# EAGLE design Proyecto etapa 1 y 2 (EAGLE 7.5.0)
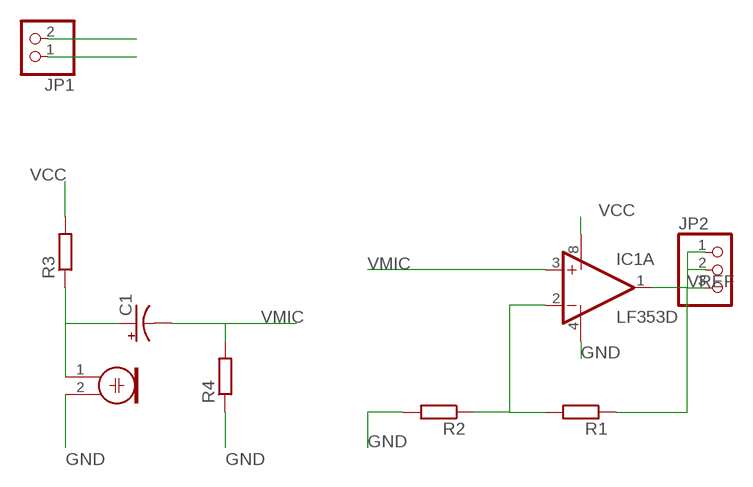
[diagram p0: schematic, sheet 1]

## Parts
C1  CPOL-USC/6032-28R  [C/6032-28R]
IC1  LF353D  [SO08]
JP1  PINHD-1X2  [1X02]
JP2  PINHD-1X3  [1X03]
M1  ELECTRET_MICROPHON-WM-62PC/62PK  [WM-62PC/62PK]
R1  R-EU_R0603  [R0603]
R2  R-EU_R0603  [R0603]
R3  R-EU_R0603  [R0603]
R4  R-EU_R0603  [R0603]

## Nets
GND: IC1.4(P:V-) JP1.2 M1.2 R2.2 R4.1
N$1: C1.+ M1.1 R3.1
N$2: IC1.2(A:-IN) R1.2 R2.1
VCC: IC1.8(P:V+) JP1.1 R3.2
VMIC: C1.- IC1.3(A:+IN) R4.2
VREF: IC1.1(A:OUT) JP2.1 JP2.2 JP2.3 R1.1
Unconnected: IC1.5(B:+IN) IC1.6(B:-IN) IC1.7(B:OUT)

## Library data of the parts
C1 = rcl:CPOL-US: POLARIZED CAPACITOR, American symbol
IC1 = linear:LF353: OP AMP
JP1 = pinhead:PINHD-1X2: PIN HEADER
JP2 = pinhead:PINHD-1X3: PIN HEADER
M1 = microphon:ELECTRET_MICROPHON-: Electret Condenser Microphone
R1-R4 = rcl:R-EU_: RESISTOR, European symbol

## Board
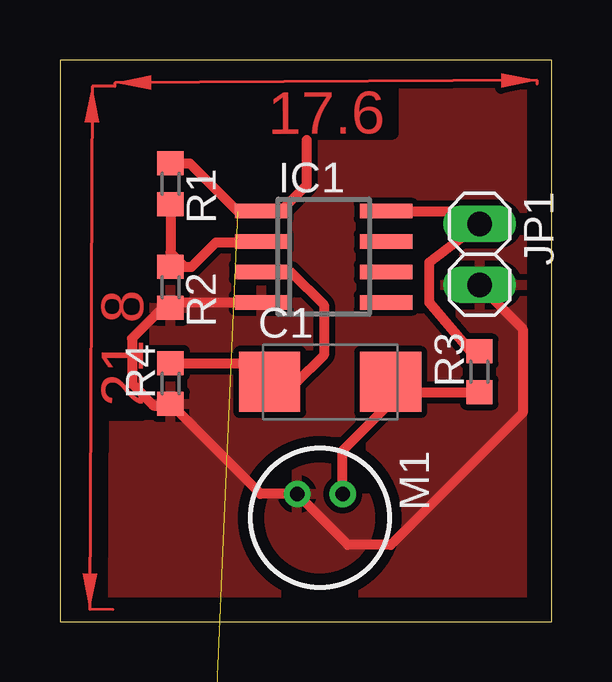
[diagram p1: board, top side]

Size 20.5 x 23.4 mm. Coordinates in mm from the lower left corner, seen from the top.
Outline: 0,0 20.5,0 20.5,23.4 0,23.4 0,0
Copper layers (1*16): Top 0.035mm / dielectric 1.5mm / Bottom 0.035mm
Design rules "default": minimum track width 10mil, minimum drill 24mil, track to track 8mil, track to pad 8mil, pad to pad 8mil, via to via 8mil, smd to smd 8mil, copper to edge 40mil, drill to drill 8mil, minimum pad ring 10mil, minimum via ring 8mil, stop-mask expansion 4mil, vias tented up to drill 0mil, thermal gap 10mil

### Footprints (pad centres in the part's own frame; a part is rotated, then mirrored left to right if it is on the bottom)
C/6032-28R = smd 2.55 x 2.5: + 2.525,0; - -2.525,0
SO08 = smd 0.6 x 2.2: 1 -1.905,-2.6; 2 -0.635,-2.6; 3 0.635,-2.6; 4 1.905,-2.6; 5 1.905,2.6; 6 0.635,2.6; 7 -0.635,2.6; 8 -1.905,2.6
1X02 = drill 1.016 long: 1 -1.27,0; 2 1.27,0
1X03 = drill 1.016 long: 1 -2.54,0; 2 0,0; 3 2.54,0
WM-62PC/62PK = drill 0.6 pad 1: 1 -1,0.95; 2 -1,-0.95
R0603 = smd 1 x 1.1: 1 -0.85,0; 2 0.85,0

### Placement (x,y rotation side)
C1  11.27,9.99 0 top
IC1  11,15.2 270 top
JP1  17.5,15.3 270 top
JP2  2.8,-29.7 0 top  (outside the outline)
M1  10.84,4.32 270 top
R1  4.61,18.24 270 top
R2  4.61,13.93 270 top
R3  17.49,10.41 90 top
R4  4.61,9.92 90 top

### Tracks (layer width: path | path; a pad name or v marks a point on that pad's centre or on a via)
GND
  Top 0.406: JP1.2 17.5,14 19.3,12.2 19.3,8.7 13.8,3.2 12.01,3.2 M1.2 8.36,5.32 R4.1 4.54,9 3.9,9 3,9.9 3,11.8 4.28,13.08 R2.2 4.83,13.29 IC1.4
  pour Top (isolate 0.254): 2.2,0.5 19.8,0.6 19.9,22.4 2.3,22.3
N$1
  Top 0.406: C1.+ 14.22,9.56 | 14.22,9.56 R3.1 | M1.1 11.79,7.12 14.22,9.56
N$2
  Top 0.406: R2.1 5.2,14.78 | 5.2,14.78 5.48,14.78 6.5,15.8 8.37,15.8 IC1.2 | R1.2 4.61,15.37 5.2,14.78
VCC
  Top 0.406: IC1.8 16.96,17.11 JP1.1 15.4,14.97 15.4,13.3 17.14,11.26 R3.2
VMIC
  Top 0.406: IC1.3 9.63,14.56 11,13.2 11,11.1 9.8,9.9 8.84,9.9 C1.- 7.96,10.77 R4.2
VREF  (3 unrouted)
  Top 0.406: R1.1 5.41,19.09 7.4,17.1 IC1.1 9.21,17.11 10.3,18.2 10.3,20.07
(copper drawn outside any net)
  shapes: Top area x2